# EAGLE design rev1_0 (EAGLE 7.6.0)
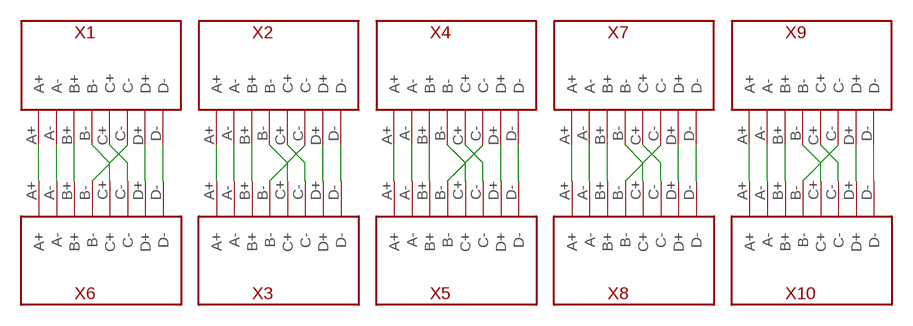
[diagram p0: schematic, sheet 1]

## Parts
X1  ETHER_BRKOUT  [ETHER_BRKOUT]
X2  ETHER_BRKOUT  [ETHER_BRKOUT]
X3  ETHER_BRKOUT  [ETHER_BRKOUT]
X4  ETHER_BRKOUT  [ETHER_BRKOUT]
X5  ETHER_BRKOUT  [ETHER_BRKOUT]
X6  ETHER_BRKOUT  [ETHER_BRKOUT]
X7  ETHER_BRKOUT  [ETHER_BRKOUT]
X8  ETHER_BRKOUT  [ETHER_BRKOUT]
X9  ETHER_BRKOUT  [ETHER_BRKOUT]
X10  ETHER_BRKOUT  [ETHER_BRKOUT]

## Nets
N$1: X1.A+ X6.A+
N$2: X1.A- X6.A-
N$3: X1.B+ X6.B+
N$4: X1.C- X6.B-
N$5: X1.B- X6.C+
N$6: X1.C+ X6.C-
N$7: X1.D+ X6.D+
N$8: X1.D- X6.D-
N$9: X2.A+ X3.A+
N$10: X2.A- X3.A-
N$11: X2.B+ X3.B+
N$12: X2.C- X3.B-
N$13: X2.B- X3.C+
N$14: X2.C+ X3.C-
N$15: X2.D+ X3.D+
N$16: X2.D- X3.D-
N$17: X4.A+ X5.A+
N$18: X4.A- X5.A-
N$19: X4.B+ X5.B+
N$20: X4.C- X5.B-
N$21: X4.B- X5.C+
N$22: X4.C+ X5.C-
N$23: X4.D+ X5.D+
N$24: X4.D- X5.D-
N$25: X7.A+ X8.A+
N$26: X7.A- X8.A-
N$27: X7.B+ X8.B+
N$28: X7.C- X8.B-
N$29: X7.B- X8.C+
N$30: X7.C+ X8.C-
N$31: X7.D+ X8.D+
N$32: X7.D- X8.D-
N$33: X9.A+ X10.A+
N$34: X9.A- X10.A-
N$35: X9.B+ X10.B+
N$36: X9.C- X10.B-
N$37: X9.B- X10.C+
N$38: X9.C+ X10.C-
N$39: X9.D+ X10.D+
N$40: X9.D- X10.D-

## Library data of the parts
X1-X10 = ETHER_BRKOUT:ETHER_BRKOUT

## Board
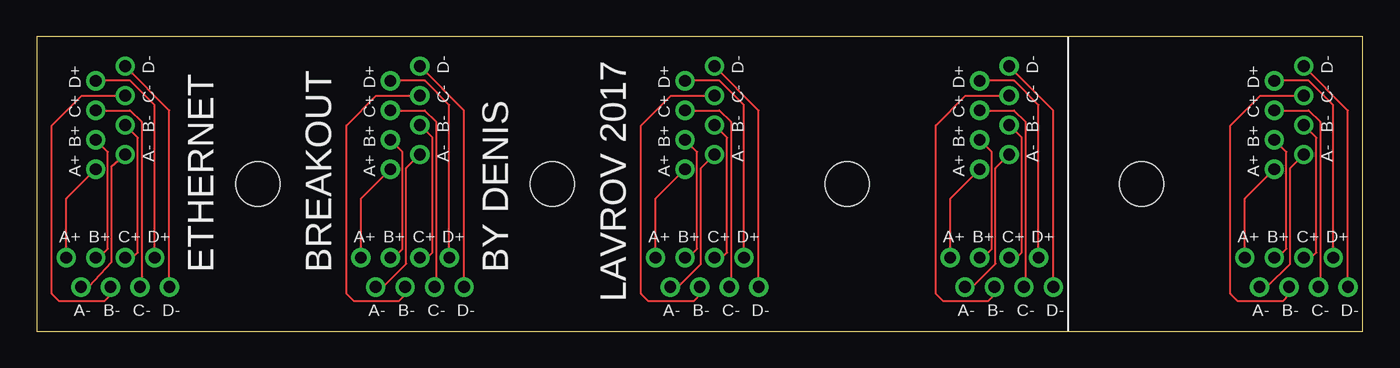
[diagram p1: board, top side]

Size 90 x 20 mm. Coordinates in mm from the lower left corner, seen from the top.
Outline: 0,0 90,0 90,20 0,20 0,0
Copper layers (1*16): Top 0.035mm / dielectric 1.5mm / Bottom 0.035mm
Design rules "SeeedStudio_2layer_DRU_no_angle_20140221 *": minimum track width 5mil, minimum drill 12mil, track to track 5mil, track to pad 5mil, pad to pad 5mil, via to via 5mil, smd to smd 0mil, copper to edge 10mil, drill to drill 10mil, minimum pad ring 10mil, minimum via ring 6mil, stop-mask expansion 2mil, vias tented up to drill 100mil, thermal gap 10mil
Holes 3 mm at 15,10 35,10 55,10 75,10

### Footprints (pad centres in the part's own frame; a part is rotated, then mirrored left to right if it is on the bottom)
ETHER_BRKOUT = drill 0.8: A+ -3,1; A- -2,-1; B+ -1,1; B- 0,-1; C+ 1,1; C- 2,-1; D+ 3,1; D- 4,-1

### Placement (x,y rotation side)
X1  5,14 90 top
X2  25,14 90 top
X3  25,4 0 top
X4  45,14 90 top
X5  45,4 0 top
X6  5,4 0 top
X7  65,14 90 top
X8  65,4 0 top
X9  85,14 90 top
X10  85,4 0 top

### Tracks (layer width: path | path; a pad name or v marks a point on that pad's centre or on a via)
N$1
  Top 0.127: X6.A+ 2,9 X1.A+
N$2
  Top 0.127: X6.A- 3.51,3 5.08,4.7 5.08,11.21 X1.A-
N$3
  Top 0.127: X6.B+ 4.24,5 4.83,5.59 4.83,12.17 X1.B+
N$4
  Top 0.127: X6.B- 5,2.46 4.57,2.03 1.52,2.03 1.02,2.54 1.02,13.97 3.05,16 X1.C-
N$5
  Top 0.127: X6.C+ 6.52,5 6.86,5.33 6.86,13.14 X1.B-
N$6
  Top 0.127: X1.C+ 6.34,15 7.11,14.22 7.11,3.11 X6.C-
N$7
  Top 0.127: X6.D+ 8,15.37 6.35,17.02 4.02,17.02 X1.D+
N$8
  Top 0.127: X6.D- 9,15 X1.D-
N$9
  Top 0.127: X3.A+ 22,9 X2.A+
N$10
  Top 0.127: X3.A- 23.51,3 25.08,4.57 25.08,11.08 X2.A-
N$11
  Top 0.127: X3.B+ 24.24,5 24.83,5.59 24.83,12.17 X2.B+
N$12
  Top 0.127: X3.B- 25,2.46 24.57,2.03 21.52,2.03 21.02,2.54 21.02,13.97 23.05,16 X2.C-
N$13
  Top 0.127: X3.C+ 26.52,5 26.86,5.33 26.86,13.14 X2.B-
N$14
  Top 0.127: X2.C+ 26.34,15 27.11,14.22 27.11,3.11 X3.C-
N$15
  Top 0.127: X3.D+ 28,15.37 26.35,17.02 24.02,17.02 X2.D+
N$16
  Top 0.127: X3.D- 29,15 X2.D-
N$17
  Top 0.127: X5.A+ 42,9 X4.A+
N$18
  Top 0.127: X5.A- 43.51,3 45.08,4.57 45.08,11.08 X4.A-
N$19
  Top 0.127: X5.B+ 44.24,5 44.83,5.59 44.83,12.17 X4.B+
N$20
  Top 0.127: X5.B- 45,2.46 44.57,2.03 41.52,2.03 41.02,2.54 41.02,13.97 43.05,16 X4.C-
N$21
  Top 0.127: X5.C+ 46.52,5 46.86,5.33 46.86,13.14 X4.B-
N$22
  Top 0.127: X4.C+ 46.34,15 47.11,14.22 47.11,3.11 X5.C-
N$23
  Top 0.127: X5.D+ 48,15.37 46.35,17.02 44.02,17.02 X4.D+
N$24
  Top 0.127: X5.D- 49,15 X4.D-
N$25
  Top 0.127: X8.A+ 62,9 X7.A+
N$26
  Top 0.127: X8.A- 63.51,3 65.08,4.57 65.08,11.08 X7.A-
N$27
  Top 0.127: X8.B+ 64.24,5 64.83,5.59 64.83,12.17 X7.B+
N$28
  Top 0.127: X8.B- 65,2.46 64.57,2.03 61.52,2.03 61.02,2.54 61.02,13.97 63.05,16 X7.C-
N$29
  Top 0.127: X8.C+ 66.52,5 66.86,5.33 66.86,13.14 X7.B-
N$30
  Top 0.127: X7.C+ 66.34,15 67.11,14.22 67.11,3.11 X8.C-
N$31
  Top 0.127: X8.D+ 68,15.37 66.35,17.02 64.02,17.02 X7.D+
N$32
  Top 0.127: X8.D- 69,15 X7.D-
N$33
  Top 0.127: X10.A+ 82,9 X9.A+
N$34
  Top 0.127: X10.A- 83.51,3 85.08,4.57 85.08,11.08 X9.A-
N$35
  Top 0.127: X10.B+ 84.24,5 84.83,5.59 84.83,12.17 X9.B+
N$36
  Top 0.127: X10.B- 85,2.46 84.57,2.03 81.52,2.03 81.02,2.54 81.02,13.97 83.05,16 X9.C-
N$37
  Top 0.127: X10.C+ 86.52,5 86.86,5.33 86.86,13.14 X9.B-
N$38
  Top 0.127: X9.C+ 86.34,15 87.11,14.22 87.11,3.11 X10.C-
N$39
  Top 0.127: X10.D+ 88,15.37 86.35,17.02 84.02,17.02 X9.D+
N$40
  Top 0.127: X10.D- 89,15 X9.D-

### Text on the board
tPlace: ETHERNET | BREAKOUT | BY DENIS | LAVROV 2017